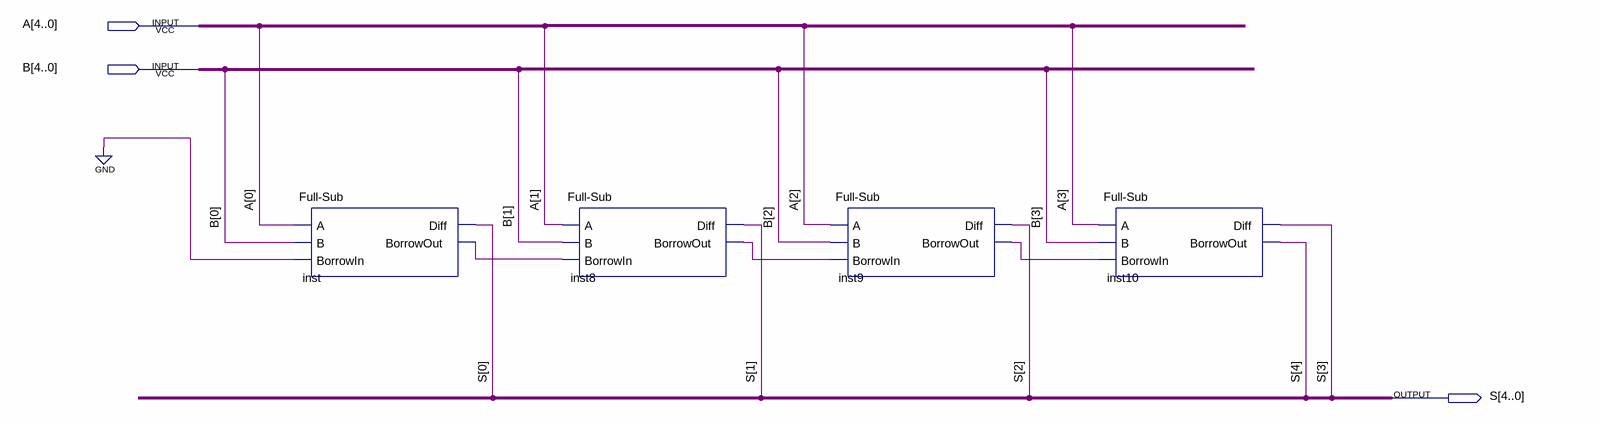
[diagram p0: schematic sheet]
// Quartus schematic SubtradorOK.bdf as structural Verilog: 4 symbols, 3 pins
module SubtradorOK (
  input  [4:0] A,
  input  [4:0] B,
  output [4:0] S
);

  wire inst8_borrowout, inst9_borrowout, inst_borrowout;

  \Full-Sub  inst (.A(A[0]), .B(B[0]), .BorrowIn(1'b0), .Diff(S[0]), .BorrowOut(inst_borrowout));
  \Full-Sub  inst8 (.A(A[1]), .B(B[1]), .BorrowIn(inst_borrowout), .Diff(S[1]), .BorrowOut(inst8_borrowout));
  \Full-Sub  inst9 (.A(A[2]), .B(B[2]), .BorrowIn(inst8_borrowout), .Diff(S[2]), .BorrowOut(inst9_borrowout));
  \Full-Sub  inst10 (.A(A[3]), .B(B[3]), .BorrowIn(inst9_borrowout), .Diff(S[3]), .BorrowOut(S[4]));
endmodule
